# Altium schematic sheet i2c_diff_passive.SchDoc
size A
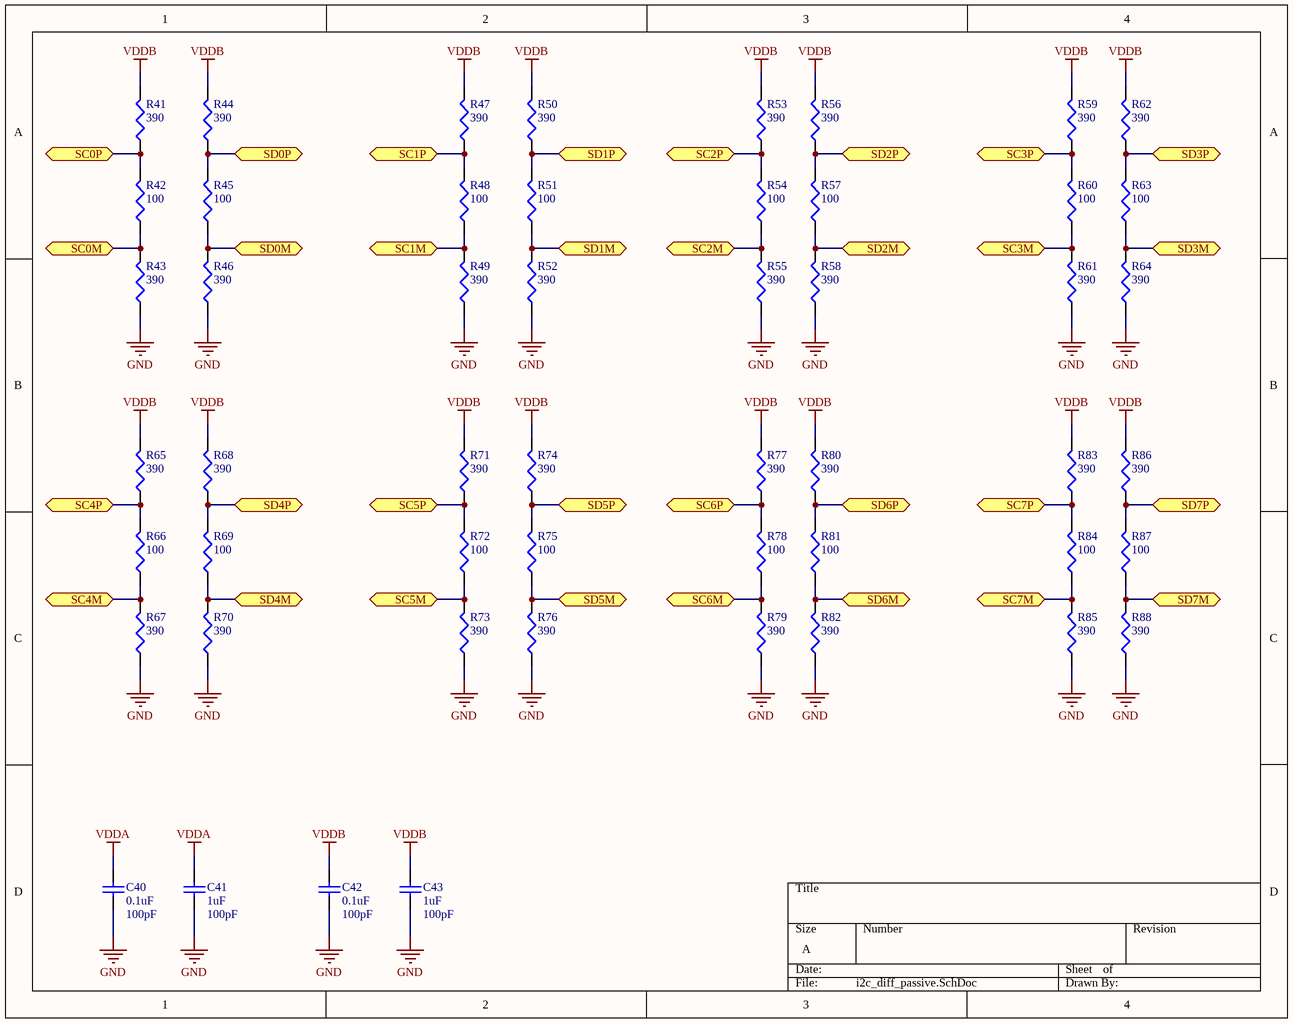
[diagram p0: i2c_diff_passive.SchDoc]

## Parts
C40  0.1uF  value 100pF  [C1206]
C41  1uF  value 100pF  [C1206]
C42  0.1uF  value 100pF  [C1206]
C43  1uF  value 100pF  [C1206]
R41  390  [J1-0603]
R42  100  [J1-0603]
R43  390  [J1-0603]
R44  390  [J1-0603]
R45  100  [J1-0603]
R46  390  [J1-0603]
R47  390  [J1-0603]
R48  100  [J1-0603]
R49  390  [J1-0603]
R50  390  [J1-0603]
R51  100  [J1-0603]
R52  390  [J1-0603]
R53  390  [J1-0603]
R54  100  [J1-0603]
R55  390  [J1-0603]
R56  390  [J1-0603]
R57  100  [J1-0603]
R58  390  [J1-0603]
R59  390  [J1-0603]
R60  100  [J1-0603]
R61  390  [J1-0603]
R62  390  [J1-0603]
R63  100  [J1-0603]
R64  390  [J1-0603]
R65  390  [J1-0603]
R66  100  [J1-0603]
R67  390  [J1-0603]
R68  390  [J1-0603]
R69  100  [J1-0603]
R70  390  [J1-0603]
R71  390  [J1-0603]
R72  100  [J1-0603]
R73  390  [J1-0603]
R74  390  [J1-0603]
R75  100  [J1-0603]
R76  390  [J1-0603]
R77  390  [J1-0603]
R78  100  [J1-0603]
R79  390  [J1-0603]
R80  390  [J1-0603]
R81  100  [J1-0603]
R82  390  [J1-0603]
R83  390  [J1-0603]
R84  100  [J1-0603]
R85  390  [J1-0603]
R86  390  [J1-0603]
R87  100  [J1-0603]
R88  390  [J1-0603]

## Ports
SC0M (bidir), SC0P (bidir), SC1M (bidir), SC1P (bidir), SC2M (bidir), SC2P (bidir), SC3M (bidir), SC3P (bidir), SC4M (bidir), SC4P (bidir), SC5M (bidir), SC5P (bidir), SC6M (bidir), SC6P (bidir), SC7M (bidir), SC7P (bidir), SD0M (bidir), SD0P (bidir), SD1M (bidir), SD1P (bidir), SD2M (bidir), SD2P (bidir), SD3M (bidir), SD3P (bidir), SD4M (bidir), SD4P (bidir), SD5M (bidir), SD5P (bidir), SD6M (bidir), SD6P (bidir), SD7M (bidir), SD7P (bidir)

## Nets
GND: C40.1 C41.1 C42.1 C43.1 R43.1 R46.1 R49.1 R52.1 R55.1 R58.1 R61.1 R64.1 R67.1 R70.1 R73.1 R76.1 R79.1 R82.1 R85.1 R88.1
VDDA: C40.2 C41.2
VDDB: C42.2 C43.2 R41.2 R44.2 R47.2 R50.2 R53.2 R56.2 R59.2 R62.2 R65.2 R68.2 R71.2 R74.2 R77.2 R80.2 R83.2 R86.2
SC0M: R42.1 R43.2 ; port SC0M
SC0P: R41.1 R42.2 ; port SC0P
SC1M: R48.1 R49.2 ; port SC1M
SC1P: R47.1 R48.2 ; port SC1P
SC2M: R54.1 R55.2 ; port SC2M
SC2P: R53.1 R54.2 ; port SC2P
SC3M: R60.1 R61.2 ; port SC3M
SC3P: R59.1 R60.2 ; port SC3P
SC4M: R66.1 R67.2 ; port SC4M
SC4P: R65.1 R66.2 ; port SC4P
SC5M: R72.1 R73.2 ; port SC5M
SC5P: R71.1 R72.2 ; port SC5P
SC6M: R78.1 R79.2 ; port SC6M
SC6P: R77.1 R78.2 ; port SC6P
SC7M: R84.1 R85.2 ; port SC7M
SC7P: R83.1 R84.2 ; port SC7P
SD0M: R45.1 R46.2 ; port SD0M
SD0P: R44.1 R45.2 ; port SD0P
SD1M: R51.1 R52.2 ; port SD1M
SD1P: R50.1 R51.2 ; port SD1P
SD2M: R57.1 R58.2 ; port SD2M
SD2P: R56.1 R57.2 ; port SD2P
SD3M: R63.1 R64.2 ; port SD3M
SD3P: R62.1 R63.2 ; port SD3P
SD4M: R69.1 R70.2 ; port SD4M
SD4P: R68.1 R69.2 ; port SD4P
SD5M: R75.1 R76.2 ; port SD5M
SD5P: R74.1 R75.2 ; port SD5P
SD6M: R81.1 R82.2 ; port SD6M
SD6P: R80.1 R81.2 ; port SD6P
SD7M: R87.1 R88.2 ; port SD7M
SD7P: R86.1 R87.2 ; port SD7P

## Library data of the parts
C40-C43 = Cap Semi: Capacitor (Semiconductor SIM Model); Published: 8-Jun-2000; LatestRevisionDate: 29-May-2009; LatestRevisionNote: IPC-7351 Footprint Added.; PackageReference: C1206; Publisher: Altium Limited; PackageDescription: Chip Capacitor
R41-R88 = Res3: Resistor; Value: 1K; Published: 8-Jun-2000; LatestRevisionDate: 29-May-2009; LatestRevisionNote: IPC-7351 Footprint Added.; PackageReference: J1-0603; Publisher: Altium Limited; PackageDescription: Chip Resistor